# Altium schematic sheet Clock_management.SchDoc
size 457 x 304 mm; DocumentNumber: 23; SheetNumber: 23; SheetTotal: 30
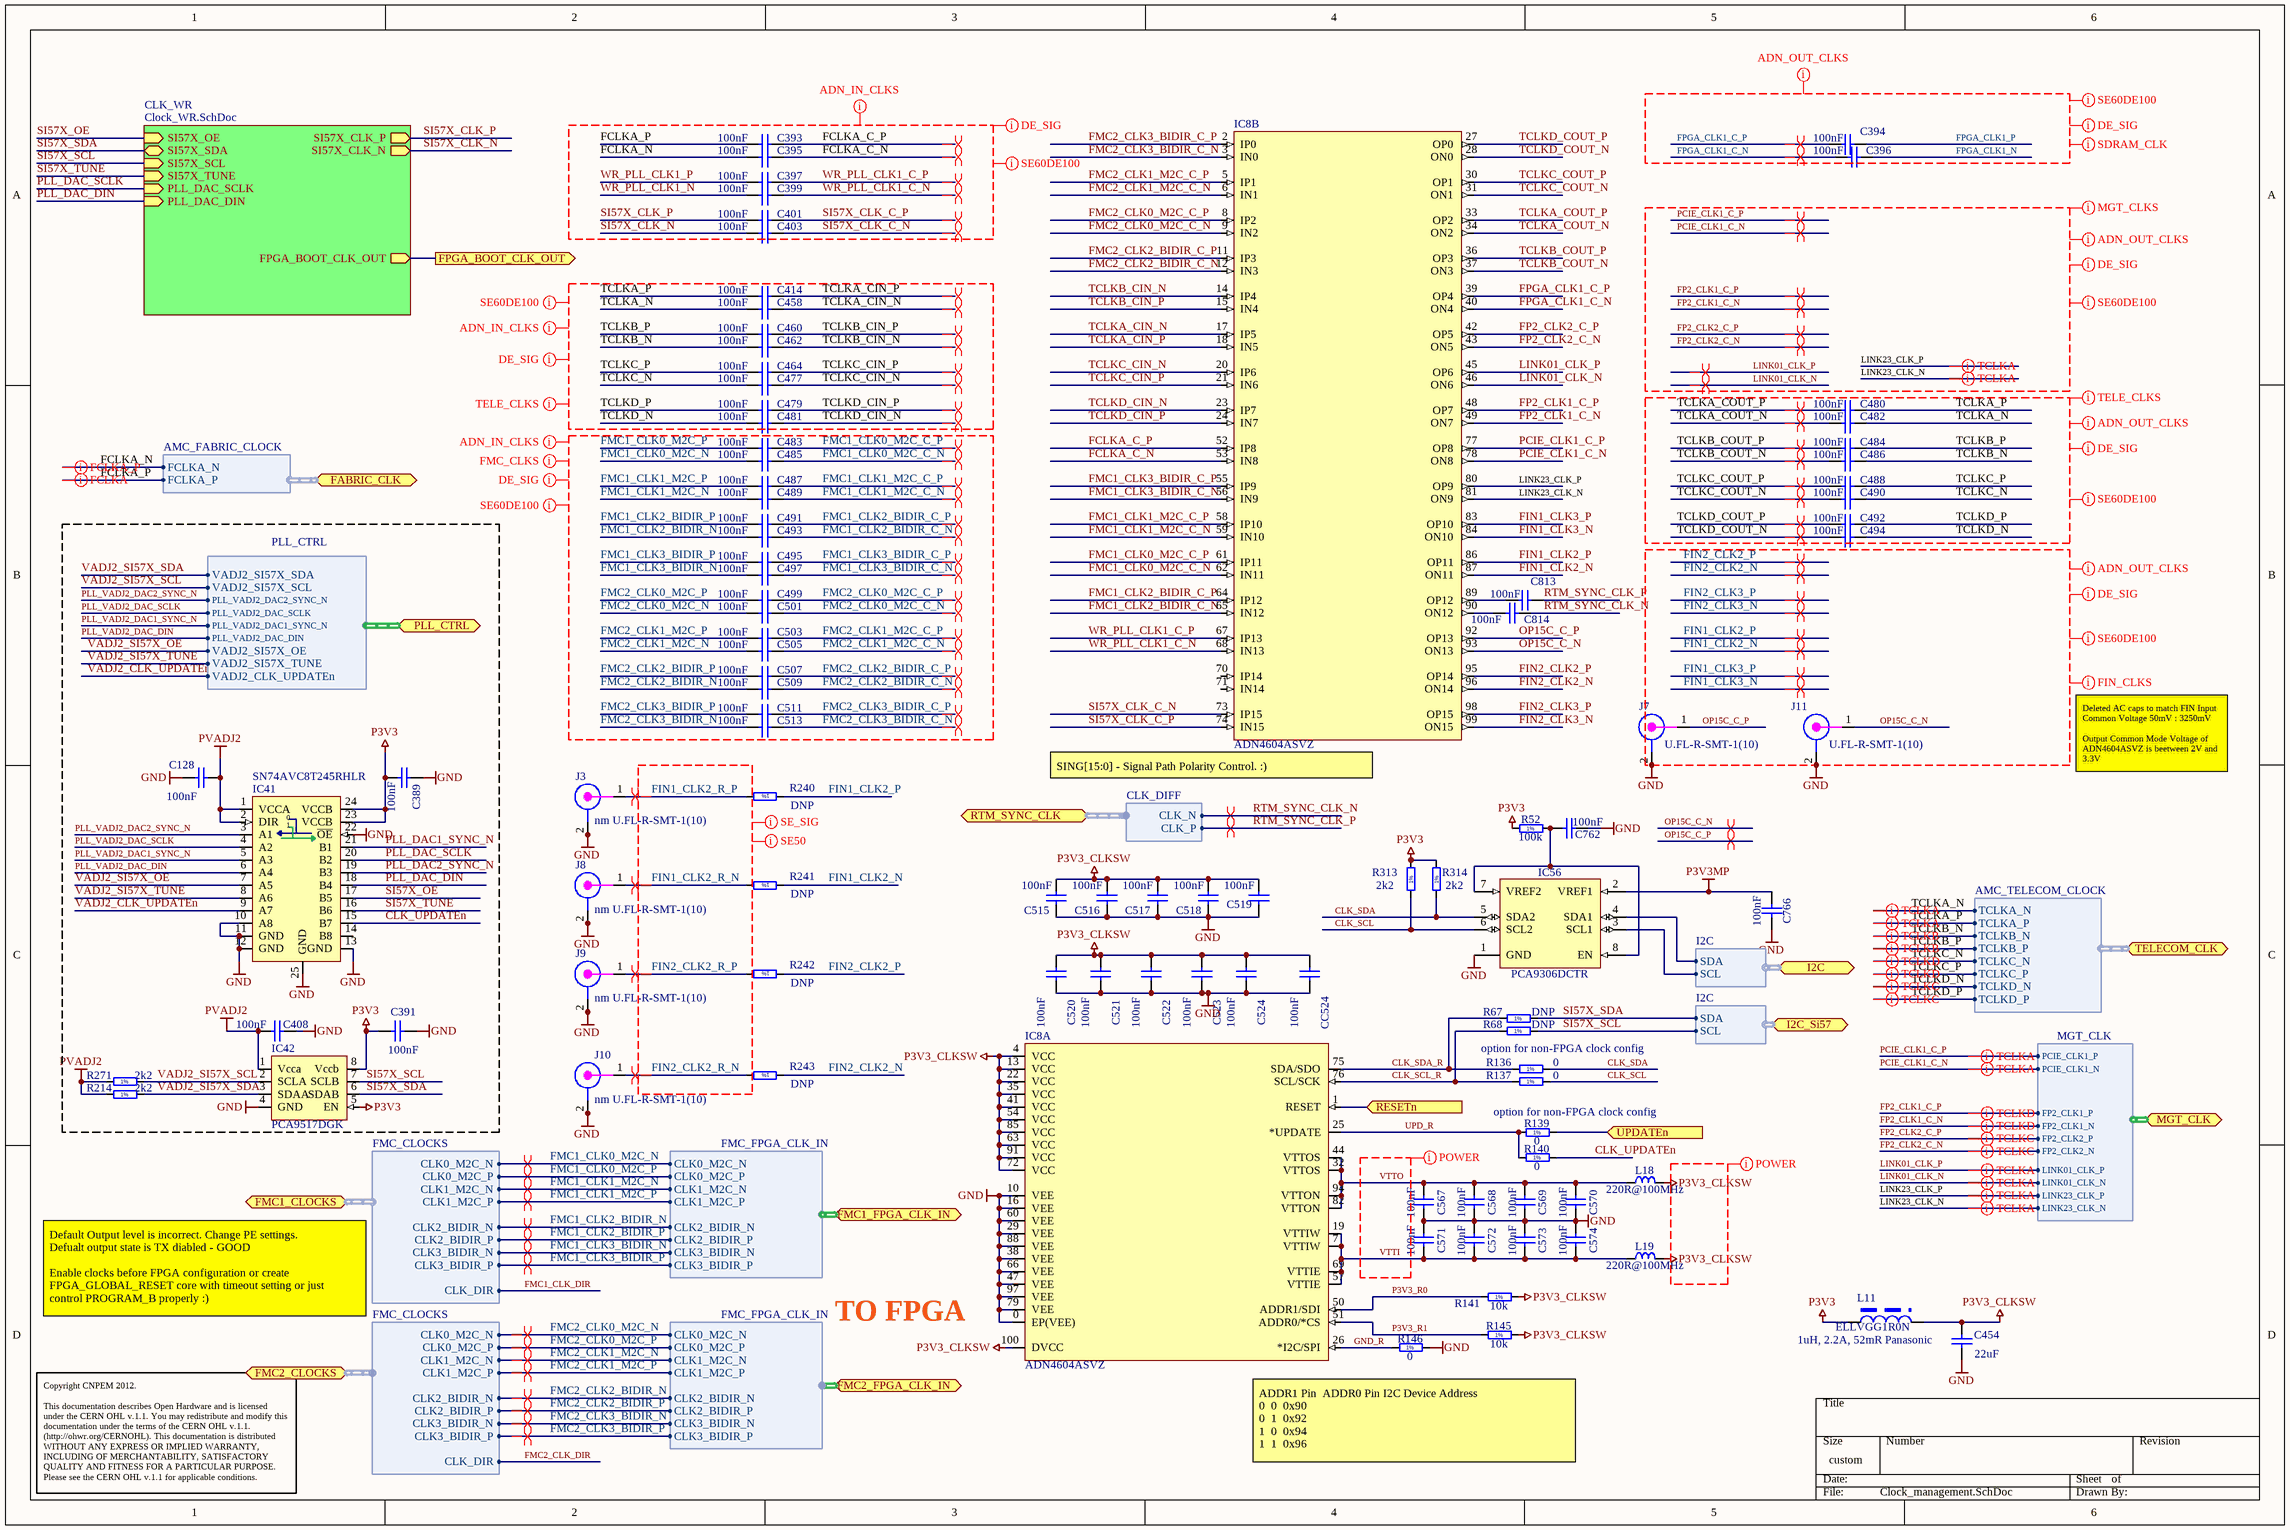
[diagram p0: Clock_management.SchDoc]

## Parts
C128  100nF  [CAPC0603X33N]
C389  100nF  [CAPC0603X33N]
C391  100nF  [CAPC0603X33N]
C393  100nF  [CAPC0603X33N]
C394  100nF  [CAPC0603X33N]
C395  100nF  [CAPC0603X33N]
C396  100nF  [CAPC0603X33N]
C397  100nF  [CAPC0603X33N]
C399  100nF  [CAPC0603X33N]
C401  100nF  [CAPC0603X33N]
C403  100nF  [CAPC0603X33N]
C408  100nF  [CAPC0603X33N]
C414  100nF  [CAPC0603X33N]
C454  22uF  [CAPC3216X180N]
C458  100nF  [CAPC0603X33N]
C460  100nF  [CAPC0603X33N]
C462  100nF  [CAPC0603X33N]
C464  100nF  [CAPC0603X33N]
C477  100nF  [CAPC0603X33N]
C479  100nF  [CAPC0603X33N]
C480  100nF  [CAPC0603X33N]
C481  100nF  [CAPC0603X33N]
C482  100nF  [CAPC0603X33N]
C483  100nF  [CAPC0603X33N]
C484  100nF  [CAPC0603X33N]
C485  100nF  [CAPC0603X33N]
C486  100nF  [CAPC0603X33N]
C487  100nF  [CAPC0603X33N]
C488  100nF  [CAPC0603X33N]
C489  100nF  [CAPC0603X33N]
C490  100nF  [CAPC0603X33N]
C491  100nF  [CAPC0603X33N]
C492  100nF  [CAPC0603X33N]
C493  100nF  [CAPC0603X33N]
C494  100nF  [CAPC0603X33N]
C495  100nF  [CAPC0603X33N]
C497  100nF  [CAPC0603X33N]
C499  100nF  [CAPC0603X33N]
C501  100nF  [CAPC0603X33N]
C503  100nF  [CAPC0603X33N]
C505  100nF  [CAPC0603X33N]
C507  100nF  [CAPC0603X33N]
C509  100nF  [CAPC0603X33N]
C511  100nF  [CAPC0603X33N]
C513  100nF  [CAPC0603X33N]
C515  100nF  [CAPC0603X33N]
C516  100nF  [CAPC0603X33N]
C517  100nF  [CAPC0603X33N]
C518  100nF  [CAPC0603X33N]
C519  100nF  [CAPC0603X33N]
C520  100nF  [CAPC0603X33N]
C521  100nF  [CAPC0603X33N]
C522  100nF  [CAPC0603X33N]
C523  100nF  [CAPC0603X33N]
C524  100nF  [CAPC0603X33N]
C567  100nF  [CAPC0603X33N]
C568  100nF  [CAPC0603X33N]
C569  100nF  [CAPC0603X33N]
C570  100nF  [CAPC0603X33N]
C571  100nF  [CAPC0603X33N]
C572  100nF  [CAPC0603X33N]
C573  100nF  [CAPC0603X33N]
C574  100nF  [CAPC0603X33N]
C762  100nF  [CAPC0603X33N]
C766  100nF  [CAPC0603X33N]
C813  100nF  [CAPC0603X33N]
C814  100nF  [CAPC0603X33N]
CC524  100nF  [CAPC0603X33N]
IC8  ADN4604ASVZ  [TQFP100_TP]  (parts A,B of 2)
IC41  SN74AVC8T245RHLR  [QFN50P350X550X100-24N]
IC42  PCA9517DGK  [msop-8]
IC56  PCA9306DCTR  [SOP65P400X130-8N]
J3  nm U.FL-R-SMT-1(10)  [CON_UFL_HIROSE_RECEPTACLE]
J7  U.FL-R-SMT-1(10)  [CON_UFL_HIROSE_RECEPTACLE]
J8  nm U.FL-R-SMT-1(10)  [CON_UFL_HIROSE_RECEPTACLE]
J9  nm U.FL-R-SMT-1(10)  [CON_UFL_HIROSE_RECEPTACLE]
J10  nm U.FL-R-SMT-1(10)  [CON_UFL_HIROSE_RECEPTACLE]
J11  U.FL-R-SMT-1(10)  [CON_UFL_HIROSE_RECEPTACLE]
L11  ELLVGG1R0N  [L_ELLVGG2R2N]
L18  220R@100MHz  [INDC2012X105N]
L19  220R@100MHz  [INDC2012X105N]
R52  100k  [RESC1005X40N]
R67  DNP  [RESC1005X40N]
R68  DNP  [RESC1005X40N]
R136  0  [RESC1005X40N]
R137  0  [RESC1005X40N]
R139  0  [RESC1005X40N]
R140  0  [RESC1005X40N]
R141  10k  [RESC1005X40N]
R145  10k  [RESC1005X40N]
R146  0  [RESC1005X40N]
R214  2k2  [RESC1005X40N]
R240  DNP  [RESC1005X40N]
R241  DNP  [RESC1005X40N]
R242  DNP  [RESC1005X40N]
R243  DNP  [RESC1005X40N]
R271  2k2  [RESC1005X40N]
R313  2k2  [RESC1005X40N]
R314  2k2  [RESC1005X40N]

## Sub-sheets
CLK_WR = Clock_WR.SchDoc: SI57X_OE (in), SI57X_SDA (bidir), SI57X_SCL (in), SI57X_CLK_P (out), SI57X_CLK_N (out), SI57X_TUNE (in), PLL_DAC_SCLK (in), PLL_DAC_DIN (in), FPGA_BOOT_CLK_OUT (out)

## Ports
FABRIC_CLK (harness AMC_FABRIC_CLOCK), FMC1_CLOCKS (harness FMC_CLOCKS), FMC1_FPGA_CLK_IN (harness FMC_FPGA_CLK_IN), FMC2_CLOCKS (harness FMC_CLOCKS), FMC2_FPGA_CLK_IN (harness FMC_FPGA_CLK_IN), FPGA_BOOT_CLK_OUT (out), I2C (harness I2C), I2C_Si57 (harness I2C), MGT_CLK (harness MGT_CLK), PLL_CTRL (harness PLL_CTRL), RESETn (in), RTM_SYNC_CLK (harness CLK_DIFF), TELECOM_CLK (harness AMC_TELECOM_CLOCK), UPDATEn (in)

## Harnesses
AMC_FABRIC_CLOCK: FCLKA_N, FCLKA_P
AMC_TELECOM_CLOCK: TCLKA_N, TCLKA_P, TCLKB_N, TCLKB_P, TCLKC_N, TCLKC_P, TCLKD_N, TCLKD_P
MGT_CLK: PCIE_CLK1_P, PCIE_CLK1_N, FP2_CLK1_P, FP2_CLK1_N, FP2_CLK2_P, FP2_CLK2_N, LINK01_CLK_P, LINK01_CLK_N, LINK23_CLK_P, LINK23_CLK_N
PLL_CTRL: PLL_VADJ2_DAC2_SYNC_N, PLL_VADJ2_DAC_SCLK, PLL_VADJ2_DAC1_SYNC_N, PLL_VADJ2_DAC_DIN, VADJ2_SI57X_OE, VADJ2_SI57X_TUNE, VADJ2_SI57X_SDA, VADJ2_SI57X_SCL, VADJ2_CLK_UPDATEn
I2C: SCL, SDA
CLK_DIFF: CLK_P, CLK_N
FMC_CLOCKS: CLK0_M2C_N, CLK0_M2C_P, CLK1_M2C_N, CLK1_M2C_P, CLK_DIR, CLK2_BIDIR_N, CLK2_BIDIR_P, CLK3_BIDIR_N, CLK3_BIDIR_P
FMC_FPGA_CLK_IN: CLK0_M2C_N, CLK0_M2C_P, CLK1_M2C_N, CLK1_M2C_P, CLK2_BIDIR_N, CLK2_BIDIR_P, CLK3_BIDIR_N, CLK3_BIDIR_P

## Nets
GND: C128.1 C389.1 C391.1 C408.1 C454.1 C515.1 C516.1 C517.1 C518.1 C519.1 C520.1 C521.1 C522.1 C523.1 C524.1 C567.1 C568.1 C569.1 C570.1 C571.2 C572.2 C573.2 C574.2 C762.2 C766.2 CC524.1 IC8.0(EP(VEE)) IC8.10(VEE) IC8.16(VEE) IC8.29(VEE) IC8.38(VEE) IC8.47(VEE) IC8.60(VEE) IC8.66(VEE) IC8.79(VEE) IC8.88(VEE) IC8.97(VEE) IC41.10(A8) IC41.11(GND) IC41.12(GND) IC41.13(GND) IC41.22(~{OE}) IC41.25(GND) IC42.4(GND) IC56.1(GND) J3.2 J3.2a(GND) J7.2 J7.2a(GND) J8.2 J8.2a(GND) J9.2 J9.2a(GND) J10.2 J10.2a(GND) J11.2 J11.2a(GND) R146.2
P3V3: C389.2 C391.2 IC41.23(VCCB) IC41.24(VCCB) IC42.5(EN) IC42.8(Vccb) L11.1 R52.1 R313.2 R314.2
P3V3_CLKSW: C454.2 C515.2 C516.2 C517.2 C518.2 C519.2 C520.2 C521.2 C522.2 C523.2 C524.2 CC524.2 IC8.4(VCC) IC8.13(VCC) IC8.22(VCC) IC8.35(VCC) IC8.41(VCC) IC8.54(VCC) IC8.63(VCC) IC8.72(VCC) IC8.85(VCC) IC8.91(VCC) IC8.100(DVCC) L11.2 L18.2 L19.2 R141.2 R145.2
P3V3MP: C766.1 IC56.2(VREF1)
PVADJ2: C128.2 C408.2 IC41.1(VCCA) IC41.2(DIR) IC42.1(Vcca) R214.1 R271.1
CLK_SCL: IC56.6(SCL2) R137.2 R313.1
CLK_SCL_R: IC8.76(SCL/SCK) R68.1 R137.1
CLK_SDA: IC56.5(SDA2) R136.2 R314.1
CLK_SDA_R: IC8.75(SDA/SDO) R67.1 R136.1
CLK_UPDATEn: IC41.15(B7) R140.2
FCLKA_C_N: C395.2 IC8.53(IN8)
FCLKA_C_P: C393.2 IC8.52(IP8)
FCLKA_N: C395.1 ; port FABRIC_CLK.FCLKA_N
FCLKA_P: C393.1 ; port FABRIC_CLK.FCLKA_P
FIN1_CLK2_N: IC8.87(ON11) R241.1
FIN1_CLK2_P: IC8.86(OP11) R240.1
FIN1_CLK2_R_N: J8.1 R241.2
FIN1_CLK2_R_P: J3.1 R240.2
FIN1_CLK3_N: IC8.84(ON10)
FIN1_CLK3_P: IC8.83(OP10)
FIN2_CLK2_N: IC8.96(ON14) R243.1
FIN2_CLK2_P: IC8.95(OP14) R242.1
FIN2_CLK2_R_N: J10.1 R243.2
FIN2_CLK2_R_P: J9.1 R242.2
FIN2_CLK3_N: IC8.99(ON15)
FIN2_CLK3_P: IC8.98(OP15)
FMC1_CLK0_M2C_C_N: C485.2 IC8.62(IN11)
FMC1_CLK0_M2C_C_P: C483.2 IC8.61(IP11)
FMC1_CLK0_M2C_N: C485.1 ; port FMC1_CLOCKS.CLK0_M2C_N, port FMC1_FPGA_CLK_IN.CLK0_M2C_N
FMC1_CLK0_M2C_P: C483.1 ; port FMC1_CLOCKS.CLK0_M2C_P, port FMC1_FPGA_CLK_IN.CLK0_M2C_P
FMC1_CLK1_M2C_C_N: C489.2 IC8.59(IN10)
FMC1_CLK1_M2C_C_P: C487.2 IC8.58(IP10)
FMC1_CLK1_M2C_N: C489.1 ; port FMC1_CLOCKS.CLK1_M2C_N, port FMC1_FPGA_CLK_IN.CLK1_M2C_N
FMC1_CLK1_M2C_P: C487.1 ; port FMC1_CLOCKS.CLK1_M2C_P, port FMC1_FPGA_CLK_IN.CLK1_M2C_P
FMC1_CLK2_BIDIR_C_N: C493.2 IC8.65(IN12)
FMC1_CLK2_BIDIR_C_P: C491.2 IC8.64(IP12)
FMC1_CLK2_BIDIR_N: C493.1 ; port FMC1_CLOCKS.CLK2_BIDIR_N, port FMC1_FPGA_CLK_IN.CLK2_BIDIR_N
FMC1_CLK2_BIDIR_P: C491.1 ; port FMC1_CLOCKS.CLK2_BIDIR_P, port FMC1_FPGA_CLK_IN.CLK2_BIDIR_P
FMC1_CLK3_BIDIR_C_N: C497.2 IC8.56(IN9)
FMC1_CLK3_BIDIR_C_P: C495.2 IC8.55(IP9)
FMC1_CLK3_BIDIR_N: C497.1 ; port FMC1_CLOCKS.CLK3_BIDIR_N, port FMC1_FPGA_CLK_IN.CLK3_BIDIR_N
FMC1_CLK3_BIDIR_P: C495.1 ; port FMC1_CLOCKS.CLK3_BIDIR_P, port FMC1_FPGA_CLK_IN.CLK3_BIDIR_P
FMC1_CLK_DIR: port FMC1_CLOCKS.CLK_DIR
FMC2_CLK0_M2C_C_N: C501.2 IC8.9(IN2)
FMC2_CLK0_M2C_C_P: C499.2 IC8.8(IP2)
FMC2_CLK0_M2C_N: C501.1 ; port FMC2_CLOCKS.CLK0_M2C_N, port FMC2_FPGA_CLK_IN.CLK0_M2C_N
FMC2_CLK0_M2C_P: C499.1 ; port FMC2_CLOCKS.CLK0_M2C_P, port FMC2_FPGA_CLK_IN.CLK0_M2C_P
FMC2_CLK1_M2C_C_N: C505.2 IC8.6(IN1)
FMC2_CLK1_M2C_C_P: C503.2 IC8.5(IP1)
FMC2_CLK1_M2C_N: C505.1 ; port FMC2_CLOCKS.CLK1_M2C_N, port FMC2_FPGA_CLK_IN.CLK1_M2C_N
FMC2_CLK1_M2C_P: C503.1 ; port FMC2_CLOCKS.CLK1_M2C_P, port FMC2_FPGA_CLK_IN.CLK1_M2C_P
FMC2_CLK2_BIDIR_C_N: C509.2 IC8.12(IN3)
FMC2_CLK2_BIDIR_C_P: C507.2 IC8.11(IP3)
FMC2_CLK2_BIDIR_N: C509.1 ; port FMC2_CLOCKS.CLK2_BIDIR_N, port FMC2_FPGA_CLK_IN.CLK2_BIDIR_N
FMC2_CLK2_BIDIR_P: C507.1 ; port FMC2_CLOCKS.CLK2_BIDIR_P, port FMC2_FPGA_CLK_IN.CLK2_BIDIR_P
FMC2_CLK3_BIDIR_C_N: C513.2 IC8.3(IN0)
FMC2_CLK3_BIDIR_C_P: C511.2 IC8.2(IP0)
FMC2_CLK3_BIDIR_N: C513.1 ; port FMC2_CLOCKS.CLK3_BIDIR_N, port FMC2_FPGA_CLK_IN.CLK3_BIDIR_N
FMC2_CLK3_BIDIR_P: C511.1 ; port FMC2_CLOCKS.CLK3_BIDIR_P, port FMC2_FPGA_CLK_IN.CLK3_BIDIR_P
FMC2_CLK_DIR: port FMC2_CLOCKS.CLK_DIR
FP2_CLK1_C_N: IC8.49(ON7) ; port MGT_CLK.FP2_CLK1_N
FP2_CLK1_C_P: IC8.48(OP7) ; port MGT_CLK.FP2_CLK1_P
FP2_CLK2_C_N: IC8.43(ON5) ; port MGT_CLK.FP2_CLK2_N
FP2_CLK2_C_P: IC8.42(OP5) ; port MGT_CLK.FP2_CLK2_P
FPGA_BOOT_CLK_OUT: port FPGA_BOOT_CLK_OUT, sheet CLK_WR/FPGA_BOOT_CLK_OUT
FPGA_CLK1_C_N: C396.1 IC8.40(ON4)
FPGA_CLK1_C_P: C394.1 IC8.39(OP4)
FPGA_CLK1_N: C396.2
FPGA_CLK1_P: C394.2
GND_R: IC8.26(*I2C/SPI) R146.1
LINK01_CLK_N: IC8.46(ON6) ; port MGT_CLK.LINK01_CLK_N
LINK01_CLK_P: IC8.45(OP6) ; port MGT_CLK.LINK01_CLK_P
LINK23_CLK_N: IC8.81(ON9) ; port MGT_CLK.LINK23_CLK_N
LINK23_CLK_P: IC8.80(OP9) ; port MGT_CLK.LINK23_CLK_P
OP15C_C_N: IC8.93(ON13) J11.1
OP15C_C_P: IC8.92(OP13) J7.1
P3V3_R0: IC8.50(ADDR1/SDI) R141.1
P3V3_R1: IC8.51(ADDR0/*CS) R145.1
PCIE_CLK1_C_N: IC8.78(ON8) ; port MGT_CLK.PCIE_CLK1_N
PCIE_CLK1_C_P: IC8.77(OP8) ; port MGT_CLK.PCIE_CLK1_P
PLL_DAC1_SYNC_N: IC41.21(B1)
PLL_DAC2_SYNC_N: IC41.19(B3)
PLL_DAC_DIN: IC41.18(B4) ; sheet CLK_WR/PLL_DAC_DIN
PLL_DAC_SCLK: IC41.20(B2) ; sheet CLK_WR/PLL_DAC_SCLK
PLL_VADJ2_DAC1_SYNC_N: IC41.5(A3) ; port PLL_CTRL.PLL_VADJ2_DAC1_SYNC_N
PLL_VADJ2_DAC2_SYNC_N: IC41.3(A1) ; port PLL_CTRL.PLL_VADJ2_DAC2_SYNC_N
PLL_VADJ2_DAC_DIN: IC41.6(A4) ; port PLL_CTRL.PLL_VADJ2_DAC_DIN
PLL_VADJ2_DAC_SCLK: IC41.4(A2) ; port PLL_CTRL.PLL_VADJ2_DAC_SCLK
RESETn: IC8.1(RESET) ; port RESETn
RTM_SYNC_CLK_N: C814.2 ; port RTM_SYNC_CLK.CLK_N
RTM_SYNC_CLK_P: C813.2 ; port RTM_SYNC_CLK.CLK_P
SI57X_CLK_C_N: C403.2 IC8.73(IP15)
SI57X_CLK_C_P: C401.2 IC8.74(IN15)
SI57X_CLK_N: C403.1 ; sheet CLK_WR/SI57X_CLK_N
SI57X_CLK_P: C401.1 ; sheet CLK_WR/SI57X_CLK_P
SI57X_OE: IC41.17(B5) ; sheet CLK_WR/SI57X_OE
SI57X_SCL: IC42.7(SCLB) R68.2 ; sheet CLK_WR/SI57X_SCL, port I2C_Si57.SCL
SI57X_SDA: IC42.6(SDAB) R67.2 ; sheet CLK_WR/SI57X_SDA, port I2C_Si57.SDA
SI57X_TUNE: IC41.16(B6) ; sheet CLK_WR/SI57X_TUNE
TCLKA_CIN_N: C458.2 IC8.17(IP5)
TCLKA_CIN_P: C414.2 IC8.18(IN5)
TCLKA_COUT_N: C482.1 IC8.34(ON2)
TCLKA_COUT_P: C480.1 IC8.33(OP2)
TCLKA_N: C458.1 C482.2 ; port TELECOM_CLK.TCLKA_N
TCLKA_P: C414.1 C480.2 ; port TELECOM_CLK.TCLKA_P
TCLKB_CIN_N: C462.2 IC8.14(IP4)
TCLKB_CIN_P: C460.2 IC8.15(IN4)
TCLKB_COUT_N: C486.1 IC8.37(ON3)
TCLKB_COUT_P: C484.1 IC8.36(OP3)
TCLKB_N: C462.1 C486.2 ; port TELECOM_CLK.TCLKB_N
TCLKB_P: C460.1 C484.2 ; port TELECOM_CLK.TCLKB_P
TCLKC_CIN_N: C477.2 IC8.20(IP6)
TCLKC_CIN_P: C464.2 IC8.21(IN6)
TCLKC_COUT_N: C490.1 IC8.31(ON1)
TCLKC_COUT_P: C488.1 IC8.30(OP1)
TCLKC_N: C477.1 C490.2 ; port TELECOM_CLK.TCLKC_N
TCLKC_P: C464.1 C488.2 ; port TELECOM_CLK.TCLKC_P
TCLKD_CIN_N: C481.2 IC8.23(IP7)
TCLKD_CIN_P: C479.2 IC8.24(IN7)
TCLKD_COUT_N: C494.1 IC8.28(ON0)
TCLKD_COUT_P: C492.1 IC8.27(OP0)
TCLKD_N: C481.1 C494.2 ; port TELECOM_CLK.TCLKD_N
TCLKD_P: C479.1 C492.2 ; port TELECOM_CLK.TCLKD_P
UPD_R: IC8.25(*UPDATE) R139.1 R140.1
UPDATEn: R139.2 ; port UPDATEn
VADJ2_CLK_UPDATEn: IC41.9(A7) ; port PLL_CTRL.VADJ2_CLK_UPDATEn
VADJ2_SI57X_OE: IC41.7(A5) ; port PLL_CTRL.VADJ2_SI57X_OE
VADJ2_SI57X_SCL: IC42.2(SCLA) R271.2 ; port PLL_CTRL.VADJ2_SI57X_SCL
VADJ2_SI57X_SDA: IC42.3(SDAA) R214.2 ; port PLL_CTRL.VADJ2_SI57X_SDA
VADJ2_SI57X_TUNE: IC41.8(A6) ; port PLL_CTRL.VADJ2_SI57X_TUNE
VTTI: C571.1 C572.1 C573.1 C574.1 IC8.7(VTTIW) IC8.19(VTTIW) IC8.57(VTTIE) IC8.69(VTTIE) L19.1
VTTO: C567.2 C568.2 C569.2 C570.2 IC8.32(VTTOS) IC8.44(VTTOS) IC8.82(VTTON) IC8.94(VTTON) L18.1
WR_PLL_CLK1_C_N: C399.2 IC8.68(IN13)
WR_PLL_CLK1_C_P: C397.2 IC8.67(IP13)
WR_PLL_CLK1_N: C399.1
WR_PLL_CLK1_P: C397.1
NetC762_1: C762.1 IC56.7(VREF2) IC56.8(EN) R52.2
NetC813_1: C813.1 IC8.89(OP12)
NetC814_1: C814.1 IC8.90(ON12)
NetIC56_3: IC56.3(SCL1) ; port I2C.SCL
NetIC56_4: IC56.4(SDA1) ; port I2C.SDA

Not connected (* = marked no-connect by the designer): IC8 70(IP14) 71(IN14); IC41 14(B8)

## Layout directives
differential pair: FCLKA_C_N, FCLKA_C_P, FCLKA_N, FCLKA_P, FIN1_CLK2_N, FIN1_CLK2_P, FIN1_CLK2_R_N, FIN1_CLK2_R_P, FIN1_CLK3_N, FIN1_CLK3_P, FIN2_CLK2_N, FIN2_CLK2_P, FIN2_CLK2_R_N, FIN2_CLK2_R_P, FIN2_CLK3_N, FIN2_CLK3_P, FMC1_CLK0_M2C_C_N, FMC1_CLK0_M2C_C_P, FMC1_CLK0_M2C_N, FMC1_CLK0_M2C_P, FMC1_CLK1_M2C_C_N, FMC1_CLK1_M2C_C_P, FMC1_CLK1_M2C_N, FMC1_CLK1_M2C_P, FMC1_CLK2_BIDIR_C_N, FMC1_CLK2_BIDIR_C_P, FMC1_CLK2_BIDIR_N, FMC1_CLK2_BIDIR_P, FMC1_CLK3_BIDIR_C_N, FMC1_CLK3_BIDIR_C_P, FMC1_CLK3_BIDIR_N, FMC1_CLK3_BIDIR_P, FMC2_CLK0_M2C_C_N, FMC2_CLK0_M2C_C_P, FMC2_CLK0_M2C_N, FMC2_CLK0_M2C_P, FMC2_CLK1_M2C_C_N, FMC2_CLK1_M2C_C_P, FMC2_CLK1_M2C_N, FMC2_CLK1_M2C_P, FMC2_CLK2_BIDIR_C_N, FMC2_CLK2_BIDIR_C_P, FMC2_CLK2_BIDIR_N, FMC2_CLK2_BIDIR_P, FMC2_CLK3_BIDIR_C_N, FMC2_CLK3_BIDIR_C_P, FMC2_CLK3_BIDIR_N, FMC2_CLK3_BIDIR_P, FP2_CLK1_C_N, FP2_CLK1_C_P, FP2_CLK2_C_N, FP2_CLK2_C_P, FPGA_CLK1_C_N, FPGA_CLK1_C_P, LINK01_CLK_N, LINK01_CLK_P, LINK23_CLK_N, LINK23_CLK_P, OP15C_C_N, OP15C_C_P, PCIE_CLK1_C_N, PCIE_CLK1_C_P, RTM_SYNC_CLK_N, RTM_SYNC_CLK_P, SI57X_CLK_C_N, SI57X_CLK_C_P, TCLKA_CIN_N, TCLKA_CIN_P, TCLKA_COUT_N, TCLKA_COUT_P, TCLKA_N, TCLKA_P, TCLKB_CIN_N, TCLKB_CIN_P, TCLKB_COUT_N, TCLKB_COUT_P, TCLKB_N, TCLKB_P, TCLKC_CIN_N, TCLKC_CIN_P, TCLKC_COUT_N, TCLKC_COUT_P, TCLKC_N, TCLKC_P, TCLKD_CIN_N, TCLKD_CIN_P, TCLKD_COUT_N, TCLKD_COUT_P, TCLKD_N, TCLKD_P, WR_PLL_CLK1_C_N, WR_PLL_CLK1_C_P
net class MGT_CLKS: FP2_CLK1_C_N, FP2_CLK1_C_P, FP2_CLK2_C_N, FP2_CLK2_C_P, LINK01_CLK_N, LINK01_CLK_P, LINK23_CLK_N, LINK23_CLK_P, PCIE_CLK1_C_N, PCIE_CLK1_C_P
net class TELE_CLKS: TCLKA_CIN_N, TCLKA_CIN_P, TCLKA_COUT_N, TCLKA_COUT_P, TCLKA_N, TCLKA_P, TCLKB_CIN_N, TCLKB_CIN_P, TCLKB_COUT_N, TCLKB_COUT_P, TCLKB_N, TCLKB_P, TCLKC_CIN_N, TCLKC_CIN_P, TCLKC_COUT_N, TCLKC_COUT_P, TCLKC_N, TCLKC_P, TCLKD_CIN_N, TCLKD_CIN_P, TCLKD_COUT_N, TCLKD_COUT_P, TCLKD_N, TCLKD_P
net class SE60DE100: FCLKA_C_N, FCLKA_C_P, FCLKA_N, FCLKA_P, FIN1_CLK2_N, FIN1_CLK2_P, FIN1_CLK3_N, FIN1_CLK3_P, FIN2_CLK2_N, FIN2_CLK2_P, FIN2_CLK3_N, FIN2_CLK3_P, FMC1_CLK0_M2C_C_N, FMC1_CLK0_M2C_C_P, FMC1_CLK0_M2C_N, FMC1_CLK0_M2C_P, FMC1_CLK1_M2C_C_N, FMC1_CLK1_M2C_C_P, FMC1_CLK1_M2C_N, FMC1_CLK1_M2C_P, FMC1_CLK2_BIDIR_C_N, FMC1_CLK2_BIDIR_C_P, FMC1_CLK2_BIDIR_N, FMC1_CLK2_BIDIR_P, FMC1_CLK3_BIDIR_C_N, FMC1_CLK3_BIDIR_C_P, FMC1_CLK3_BIDIR_N, FMC1_CLK3_BIDIR_P, FMC2_CLK0_M2C_C_N, FMC2_CLK0_M2C_C_P, FMC2_CLK0_M2C_N, FMC2_CLK0_M2C_P, FMC2_CLK1_M2C_C_N, FMC2_CLK1_M2C_C_P, FMC2_CLK1_M2C_N, FMC2_CLK1_M2C_P, FMC2_CLK2_BIDIR_C_N, FMC2_CLK2_BIDIR_C_P, FMC2_CLK2_BIDIR_N, FMC2_CLK2_BIDIR_P, FMC2_CLK3_BIDIR_C_N, FMC2_CLK3_BIDIR_C_P, FMC2_CLK3_BIDIR_N, FMC2_CLK3_BIDIR_P, FP2_CLK1_C_N, FP2_CLK1_C_P, FP2_CLK2_C_N, FP2_CLK2_C_P, FPGA_CLK1_C_N, FPGA_CLK1_C_P, FPGA_CLK1_N, FPGA_CLK1_P, GND, LINK01_CLK_N, LINK01_CLK_P, LINK23_CLK_N, LINK23_CLK_P, OP15C_C_N, OP15C_C_P, PCIE_CLK1_C_N, PCIE_CLK1_C_P, SI57X_CLK_C_N, SI57X_CLK_C_P, SI57X_CLK_N, SI57X_CLK_P, TCLKA_CIN_N, TCLKA_CIN_P, TCLKA_COUT_N, TCLKA_COUT_P, TCLKA_N, TCLKA_P, TCLKB_CIN_N, TCLKB_CIN_P, TCLKB_COUT_N, TCLKB_COUT_P, TCLKB_N, TCLKB_P, TCLKC_CIN_N, TCLKC_CIN_P, TCLKC_COUT_N, TCLKC_COUT_P, TCLKC_N, TCLKC_P, TCLKD_CIN_N, TCLKD_CIN_P, TCLKD_COUT_N, TCLKD_COUT_P, TCLKD_N, TCLKD_P, WR_PLL_CLK1_C_N, WR_PLL_CLK1_C_P, WR_PLL_CLK1_N, WR_PLL_CLK1_P
net class SDRAM_CLK: FPGA_CLK1_C_N, FPGA_CLK1_C_P, FPGA_CLK1_N, FPGA_CLK1_P
net class FMC_CLKS: FIN1_CLK2_N, FIN1_CLK2_P, FIN1_CLK3_N, FIN1_CLK3_P, FIN2_CLK2_N, FIN2_CLK2_P, FIN2_CLK3_N, FIN2_CLK3_P, FMC1_CLK0_M2C_C_N, FMC1_CLK0_M2C_C_P, FMC1_CLK0_M2C_N, FMC1_CLK0_M2C_P, FMC1_CLK1_M2C_C_N, FMC1_CLK1_M2C_C_P, FMC1_CLK1_M2C_N, FMC1_CLK1_M2C_P, FMC1_CLK2_BIDIR_C_N, FMC1_CLK2_BIDIR_C_P, FMC1_CLK2_BIDIR_N, FMC1_CLK2_BIDIR_P, FMC1_CLK3_BIDIR_C_N, FMC1_CLK3_BIDIR_C_P, FMC1_CLK3_BIDIR_N, FMC1_CLK3_BIDIR_P, FMC2_CLK0_M2C_C_N, FMC2_CLK0_M2C_C_P, FMC2_CLK0_M2C_N, FMC2_CLK0_M2C_P, FMC2_CLK1_M2C_C_N, FMC2_CLK1_M2C_C_P, FMC2_CLK1_M2C_N, FMC2_CLK1_M2C_P, FMC2_CLK2_BIDIR_C_N, FMC2_CLK2_BIDIR_C_P, FMC2_CLK2_BIDIR_N, FMC2_CLK2_BIDIR_P, FMC2_CLK3_BIDIR_C_N, FMC2_CLK3_BIDIR_C_P, FMC2_CLK3_BIDIR_N, FMC2_CLK3_BIDIR_P, GND, OP15C_C_N, OP15C_C_P
net class DE_SIG: FCLKA_C_N, FCLKA_C_P, FCLKA_N, FCLKA_P, FIN1_CLK2_N, FIN1_CLK2_P, FIN1_CLK3_N, FIN1_CLK3_P, FIN2_CLK2_N, FIN2_CLK2_P, FIN2_CLK3_N, FIN2_CLK3_P, FMC1_CLK0_M2C_C_N, FMC1_CLK0_M2C_C_P, FMC1_CLK0_M2C_N, FMC1_CLK0_M2C_P, FMC1_CLK1_M2C_C_N, FMC1_CLK1_M2C_C_P, FMC1_CLK1_M2C_N, FMC1_CLK1_M2C_P, FMC1_CLK2_BIDIR_C_N, FMC1_CLK2_BIDIR_C_P, FMC1_CLK2_BIDIR_N, FMC1_CLK2_BIDIR_P, FMC1_CLK3_BIDIR_C_N, FMC1_CLK3_BIDIR_C_P, FMC1_CLK3_BIDIR_N, FMC1_CLK3_BIDIR_P, FMC2_CLK0_M2C_C_N, FMC2_CLK0_M2C_C_P, FMC2_CLK0_M2C_N, FMC2_CLK0_M2C_P, FMC2_CLK1_M2C_C_N, FMC2_CLK1_M2C_C_P, FMC2_CLK1_M2C_N, FMC2_CLK1_M2C_P, FMC2_CLK2_BIDIR_C_N, FMC2_CLK2_BIDIR_C_P, FMC2_CLK2_BIDIR_N, FMC2_CLK2_BIDIR_P, FMC2_CLK3_BIDIR_C_N, FMC2_CLK3_BIDIR_C_P, FMC2_CLK3_BIDIR_N, FMC2_CLK3_BIDIR_P, FP2_CLK1_C_N, FP2_CLK1_C_P, FP2_CLK2_C_N, FP2_CLK2_C_P, FPGA_CLK1_C_N, FPGA_CLK1_C_P, FPGA_CLK1_N, FPGA_CLK1_P, GND, LINK01_CLK_N, LINK01_CLK_P, LINK23_CLK_N, LINK23_CLK_P, OP15C_C_N, OP15C_C_P, PCIE_CLK1_C_N, PCIE_CLK1_C_P, SI57X_CLK_C_N, SI57X_CLK_C_P, SI57X_CLK_N, SI57X_CLK_P, TCLKA_CIN_N, TCLKA_CIN_P, TCLKA_COUT_N, TCLKA_COUT_P, TCLKA_N, TCLKA_P, TCLKB_CIN_N, TCLKB_CIN_P, TCLKB_COUT_N, TCLKB_COUT_P, TCLKB_N, TCLKB_P, TCLKC_CIN_N, TCLKC_CIN_P, TCLKC_COUT_N, TCLKC_COUT_P, TCLKC_N, TCLKC_P, TCLKD_CIN_N, TCLKD_CIN_P, TCLKD_COUT_N, TCLKD_COUT_P, TCLKD_N, TCLKD_P, WR_PLL_CLK1_C_N, WR_PLL_CLK1_C_P, WR_PLL_CLK1_N, WR_PLL_CLK1_P
net class POWER: (no net found under the mark), VTTI, VTTO
net class ADN_IN_CLKS: FCLKA_C_N, FCLKA_C_P, FCLKA_N, FCLKA_P, FMC1_CLK0_M2C_C_N, FMC1_CLK0_M2C_C_P, FMC1_CLK0_M2C_N, FMC1_CLK0_M2C_P, FMC1_CLK1_M2C_C_N, FMC1_CLK1_M2C_C_P, FMC1_CLK1_M2C_N, FMC1_CLK1_M2C_P, FMC1_CLK2_BIDIR_C_N, FMC1_CLK2_BIDIR_C_P, FMC1_CLK2_BIDIR_N, FMC1_CLK2_BIDIR_P, FMC1_CLK3_BIDIR_C_N, FMC1_CLK3_BIDIR_C_P, FMC1_CLK3_BIDIR_N, FMC1_CLK3_BIDIR_P, FMC2_CLK0_M2C_C_N, FMC2_CLK0_M2C_C_P, FMC2_CLK0_M2C_N, FMC2_CLK0_M2C_P, FMC2_CLK1_M2C_C_N, FMC2_CLK1_M2C_C_P, FMC2_CLK1_M2C_N, FMC2_CLK1_M2C_P, FMC2_CLK2_BIDIR_C_N, FMC2_CLK2_BIDIR_C_P, FMC2_CLK2_BIDIR_N, FMC2_CLK2_BIDIR_P, FMC2_CLK3_BIDIR_C_N, FMC2_CLK3_BIDIR_C_P, FMC2_CLK3_BIDIR_N, FMC2_CLK3_BIDIR_P, SI57X_CLK_C_N, SI57X_CLK_C_P, SI57X_CLK_N, SI57X_CLK_P, TCLKA_CIN_N, TCLKA_CIN_P, TCLKA_N, TCLKA_P, TCLKB_CIN_N, TCLKB_CIN_P, TCLKB_N, TCLKB_P, TCLKC_CIN_N, TCLKC_CIN_P, TCLKC_N, TCLKC_P, TCLKD_CIN_N, TCLKD_CIN_P, TCLKD_N, TCLKD_P, WR_PLL_CLK1_C_N, WR_PLL_CLK1_C_P, WR_PLL_CLK1_N, WR_PLL_CLK1_P
net class ADN_OUT_CLKS: FIN1_CLK2_N, FIN1_CLK2_P, FIN1_CLK3_N, FIN1_CLK3_P, FIN2_CLK2_N, FIN2_CLK2_P, FIN2_CLK3_N, FIN2_CLK3_P, FP2_CLK1_C_N, FP2_CLK1_C_P, FP2_CLK2_C_N, FP2_CLK2_C_P, FPGA_CLK1_C_N, FPGA_CLK1_C_P, FPGA_CLK1_N, FPGA_CLK1_P, GND, LINK01_CLK_N, LINK01_CLK_P, LINK23_CLK_N, LINK23_CLK_P, OP15C_C_N, OP15C_C_P, PCIE_CLK1_C_N, PCIE_CLK1_C_P, TCLKA_COUT_N, TCLKA_COUT_P, TCLKA_N, TCLKA_P, TCLKB_COUT_N, TCLKB_COUT_P, TCLKB_N, TCLKB_P, TCLKC_COUT_N, TCLKC_COUT_P, TCLKC_N, TCLKC_P, TCLKD_COUT_N, TCLKD_COUT_P, TCLKD_N, TCLKD_P
net class SE_SIG: FIN1_CLK2_R_N, FIN1_CLK2_R_P, FIN2_CLK2_R_N, FIN2_CLK2_R_P
net class SE50: FIN1_CLK2_R_N, FIN1_CLK2_R_P, FIN2_CLK2_R_N, FIN2_CLK2_R_P

## Notes on the sheet
- (near IC8) SING[15:0] - Signal Path Polarity Control. :)
- Deleted AC caps to match FIN Input Common Voltage 50mV : 3250mV
  Output Common Mode Voltage of ADN4604ASVZ is beetween 2V and 3.3V
- option for non-FPGA clock config
- (near R139) option for non-FPGA clock config
- Default Output level is incorrect. Change PE settings.
  Defualt output state is TX diabled - GOOD
  Enable clocks before FPGA configuration or create FPGA_GLOBAL_RESET core with timeout setting or just control PROGRAM_B properly :)
- TO FPGA
- Copyright CNPEM 2012.
  This documentation describes Open Hardware and is licensed under the CERN OHL v.1.1. You may redistribute and modify this documentation under the terms of the CERN OHL v.1.1. (http://ohwr.org/CERNOHL). This documentation is distributed WITHOUT ANY EXPRESS OR IMPLIED WARRANTY, INCLUDING OF MERCHANTABILITY, SATISFACTORY QUALITY AND FITNESS FOR A PARTICULAR PURPOSE. Please see the CERN OHL v.1.1 for applicable conditions.
- ADDR1 Pin 	ADDR0 Pin	I2C Device Address
  0		0		0x90
  0		1		0x92
  1		0		0x94
  1		1		0x96
- (in symbol 74AVC8T245_QFN) 0
- (in symbol L_CHOKE_ELLVGG) 1uH, 2.2A, 52mR Panasonic
- (in symbol R0402_0R_JUMPER) 1%
- (in symbol R0402_2K2_1%_0.0625W_100PPM) 1%
- (in symbol R0402_10K_1%_0.0625W_100PPM) 1%
- (in symbol R0402_100K_1%_0.0625W_100PPM) 1%

## Library data of the parts
C128 C389 C391 C393-C397 C399 C401 C403 C408 C414 C458 C460 C462 C464 C477 C479-C495 C497 C499 C501 C503 C505 C507 C509 C511 C513 C515-C524 C567-C574 C762 C766 C813 C814 CC524 = CC0201_100NF_6.3V_10%_X5R: Non-polarised capacitor; Part Description: SMD Multilayer Chip Ceramic Capacitor; Manufacturer: GENERIC; Manufacturer1 Part Number: 02016D104KAT2A; Voltage: 6.3V; TC: X5R; Tolerance: ±10%; Table: Capacitors SMD; Part Number: CC0201_100NF_6.3V_10%_X5R; Component Kind: Standard; Component Type: Standard; Pin Count: 2; Value: 100nF; Status: Not Recommended; Manufacturer Part Number: CC0201_100NF_6.3V_10%_X5R; Case: 0201; Mounted: Yes; Socket: No; SMD: Yes; Manufacturer1 Example: AVX; Manufacturer1 ComponentHeight: 0.33mm; HelpURL: \\cern.ch\dfs\Applications\Altium\Datasheets\CC0201_X5R_AVX.pdf; Author: CERN DEM JLC; CreateDate: 2007-12-03; LatestRevisionDate: 2007-12-03
C454 = CC1206_22UF_10V_10%_X7R: Non-polarised capacitor; Part Description: SMD Multilayer Chip Ceramic Capacitor; Manufacturer: GENERIC; Manufacturer1 Part Number: GRM31CR71A226KE15L; Voltage: 10V; TC: X7R; Tolerance: ±10%; Table: Capacitors SMD; Part Number: CC1206_22UF_10V_10%_X7R; Component Kind: Standard; Component Type: Standard; Pin Count: 2; Value: 22uF; Status: Preferred; Manufacturer Part Number: CC1206_22UF_10V_10%_X7R; Case: 1206; Mounted: Yes; Socket: No; SMD: Yes; Manufacturer1 Example: MURATA; Manufacturer1 ComponentHeight: 1.8mm; HelpURL: \\cern.ch\dfs\Applications\Altium\Datasheets\CC1206_X7R_MURATA_GRM-HI-CAP.pdf; Author: CERN DEM JLC; CreateDate: 2010-06-08; LatestRevisionDate: 2010-06-08
IC8 = IFC_ADN4604ASVZ: 16x16 CML crosspoint switch; RefDes: RefDes; Type: DEV; Value: Value
IC41 = 74AVC8T245_QFN: 8 channel bidir translator buffer (1.4..3.6V)
IC42 = IFC_PCA9517: LEVEL-TRANSLATING I2C BUS REPEATER
IC56 = PCA9306DCTR: Dual Bidirectional I2C Bus And SMBus Voltage-Level Translator; Manufacturer: TEXAS INSTRUMENTS; Table: Analog & Interface; Part Number: PCA9306DCTR; Component Kind: Standard; Component Type: Standard; Device: PCA9306DCTR; PackageDescription: SOP, 0.65mm, Pitch; 8 Pin, 2.80mm W X 2.95mm L X 1.30mm H Body, PC Medium Density; Part Description: Dual Bidirectional I2C Bus And SMBus Voltage-Level Translator; Manufacturer Part Number: PCA9306DCTR; Pin Count: 8; Case: SSOP8; Mounted: Yes; Socket: No; SMD: Yes; ComponentHeight: 1.3mm; Author: CERN DEM JLC; HelpURL: \\cern.ch\dfs\Applications\Altium\Datasheets\PCA9306DCTR.pdf; CreateDate: 2013-02-25; LatestRevisionDate: 2013-02-25
J3 J7-J11 = CON_UFL_SMD: UFL; Supplier 1: Newark; Supplier Part Number 1: 50P8856
L11 = L_CHOKE_ELLVGG: 2.2uH, 1.4A, 92mR Panasonic
L18 L19 = IND0805_MURATA_BLM21PG221SN1D: Inductor; Part Description: SMD EMIFIL Suppression Chip Ferrite Bead; Manufacturer: MURATA; Power: 2A; Resistance: 0.05R; Tolerance: ±25%; Table: Inductors SMD; Part Number: IND0805_MURATA_BLM21PG221SN1D; Component Kind: Standard; Component Type: Standard; Pin Count: 2; Value: 220R@100MHz; Status: None; Manufacturer Part Number: BLM21PG221SN1D; Case: 0805; Mounted: Yes; Socket: No; SMD: Yes; ComponentHeight: 1.05mm; HelpURL: \\cern.ch\dfs\Applications\Altium\Datasheets\IND0402_MURATA_BLM21P.pdf; Author: CERN DEM JLC; CreateDate: 2010-01-25; LatestRevisionDate: 2010-01-25
R52 = R0402_100K_1%_0.0625W_100PPM: Resistor - 1%; Part Description: General Purpose Thick Film Chip Resistor; Manufacturer: GENERIC; Manufacturer1 Part Number: 232270671004L; TC: ±100ppm/°C; Table: Resistors SMD; Part Number: R0402_100K_1%_0.0625W_100PPM; Component Kind: Standard; Component Type: Standard; Pin Count: 2; Value: 100k; Status: Not recommended; Power: 0.0625W; Tolerance: ±1%; Manufacturer Part Number: R0402_100K_1%_0.0625W_100PPM; Case: 0402; Mounted: Yes; Socket: No; SMD: Yes; Manufacturer1 Example: YAGEO PHYCOMP; Manufacturer1 ComponentHeight: 0.4mm; HelpURL: \\cern.ch\dfs\Applications\Altium\Datasheets\R0402_Phycomp_RC0402.pdf; Author: CERN DEM JLC; CreateDate: 2007-12-03; LatestRevisionDate: 2012-10-17
R67 R68 R240-R243 = R0402_0R_JUMPER: Resistor - 1%; Part Description: 1A (0.05R Max DC Resistance) Zero Ohm Jumper; Manufacturer: GENERIC; Manufacturer1 Part Number: 232270591001L; Value: 0; Table: Resistors SMD; Part Number: R0402_0R_JUMPER; Component Kind: Standard; Component Type: Standard; Pin Count: 2; Status: Not recommended; Manufacturer Part Number: R0402_0R_JUMPER; Case: 0402; Mounted: Yes; Socket: No; SMD: Yes; Manufacturer1 Example: YAGEO PHYCOMP; Manufacturer1 ComponentHeight: 0.4mm; HelpURL: \\cern.ch\dfs\Applications\Altium\Datasheets\R0402_Phycomp_RC0402.pdf; Author: CERN DEM JLC; CreateDate: 2007-12-03; LatestRevisionDate: 2012-10-17
R136 R137 R139 R140 R146 = R0402_0R_JUMPER: Resistor - 1%; Part Description: 1A (0.05R Max DC Resistance) Zero Ohm Jumper; Manufacturer: GENERIC; Manufacturer1 Part Number: 232270591001L; Table: Resistors SMD; Part Number: R0402_0R_JUMPER; Component Kind: Standard; Component Type: Standard; Pin Count: 2; Value: 0; Status: Not recommended; Manufacturer Part Number: R0402_0R_JUMPER; Case: 0402; Mounted: Yes; Socket: No; SMD: Yes; Manufacturer1 Example: YAGEO PHYCOMP; Manufacturer1 ComponentHeight: 0.4mm; HelpURL: \\cern.ch\dfs\Applications\Altium\Datasheets\R0402_Phycomp_RC0402.pdf; Author: CERN DEM JLC; CreateDate: 2007-12-03; LatestRevisionDate: 2012-10-17
R141 R145 = R0402_10K_1%_0.0625W_100PPM: Resistor - 1%; Part Description: General Purpose Thick Film Chip Resistor; Manufacturer: GENERIC; Manufacturer1 Part Number: 232270671003L; TC: ±100ppm/°C; Table: Resistors SMD; Part Number: R0402_10K_1%_0.0625W_100PPM; Component Kind: Standard; Component Type: Standard; Pin Count: 2; Value: 10k; Status: Not recommended; Power: 0.0625W; Tolerance: ±1%; Manufacturer Part Number: R0402_10K_1%_0.0625W_100PPM; Case: 0402; Mounted: Yes; Socket: No; SMD: Yes; Manufacturer1 Example: YAGEO PHYCOMP; Manufacturer1 ComponentHeight: 0.4mm; HelpURL: \\cern.ch\dfs\Applications\Altium\Datasheets\R0402_Phycomp_RC0402.pdf; Author: CERN DEM JLC; CreateDate: 2007-12-03; LatestRevisionDate: 2012-10-17
R214 R271 R313 R314 = R0402_2K2_1%_0.0625W_100PPM: Resistor - 1%; Part Description: General Purpose Thick Film Chip Resistor; Manufacturer: GENERIC; Manufacturer1 Part Number: 232270672202L; TC: ±100ppm/°C; Table: Resistors SMD; Part Number: R0402_2K2_1%_0.0625W_100PPM; Component Kind: Standard; Component Type: Standard; Pin Count: 2; Value: 2k2; Status: Not recommended; Power: 0.0625W; Tolerance: ±1%; Manufacturer Part Number: R0402_2K2_1%_0.0625W_100PPM; Case: 0402; Mounted: Yes; Socket: No; SMD: Yes; Manufacturer1 Example: YAGEO PHYCOMP; Manufacturer1 ComponentHeight: 0.4mm; HelpURL: \\cern.ch\dfs\Applications\Altium\Datasheets\R0402_Phycomp_RC0402.pdf; Author: CERN DEM JLC; CreateDate: 2007-12-03; LatestRevisionDate: 2012-10-17